# EAGLE design badge (EAGLE 6.5.0)
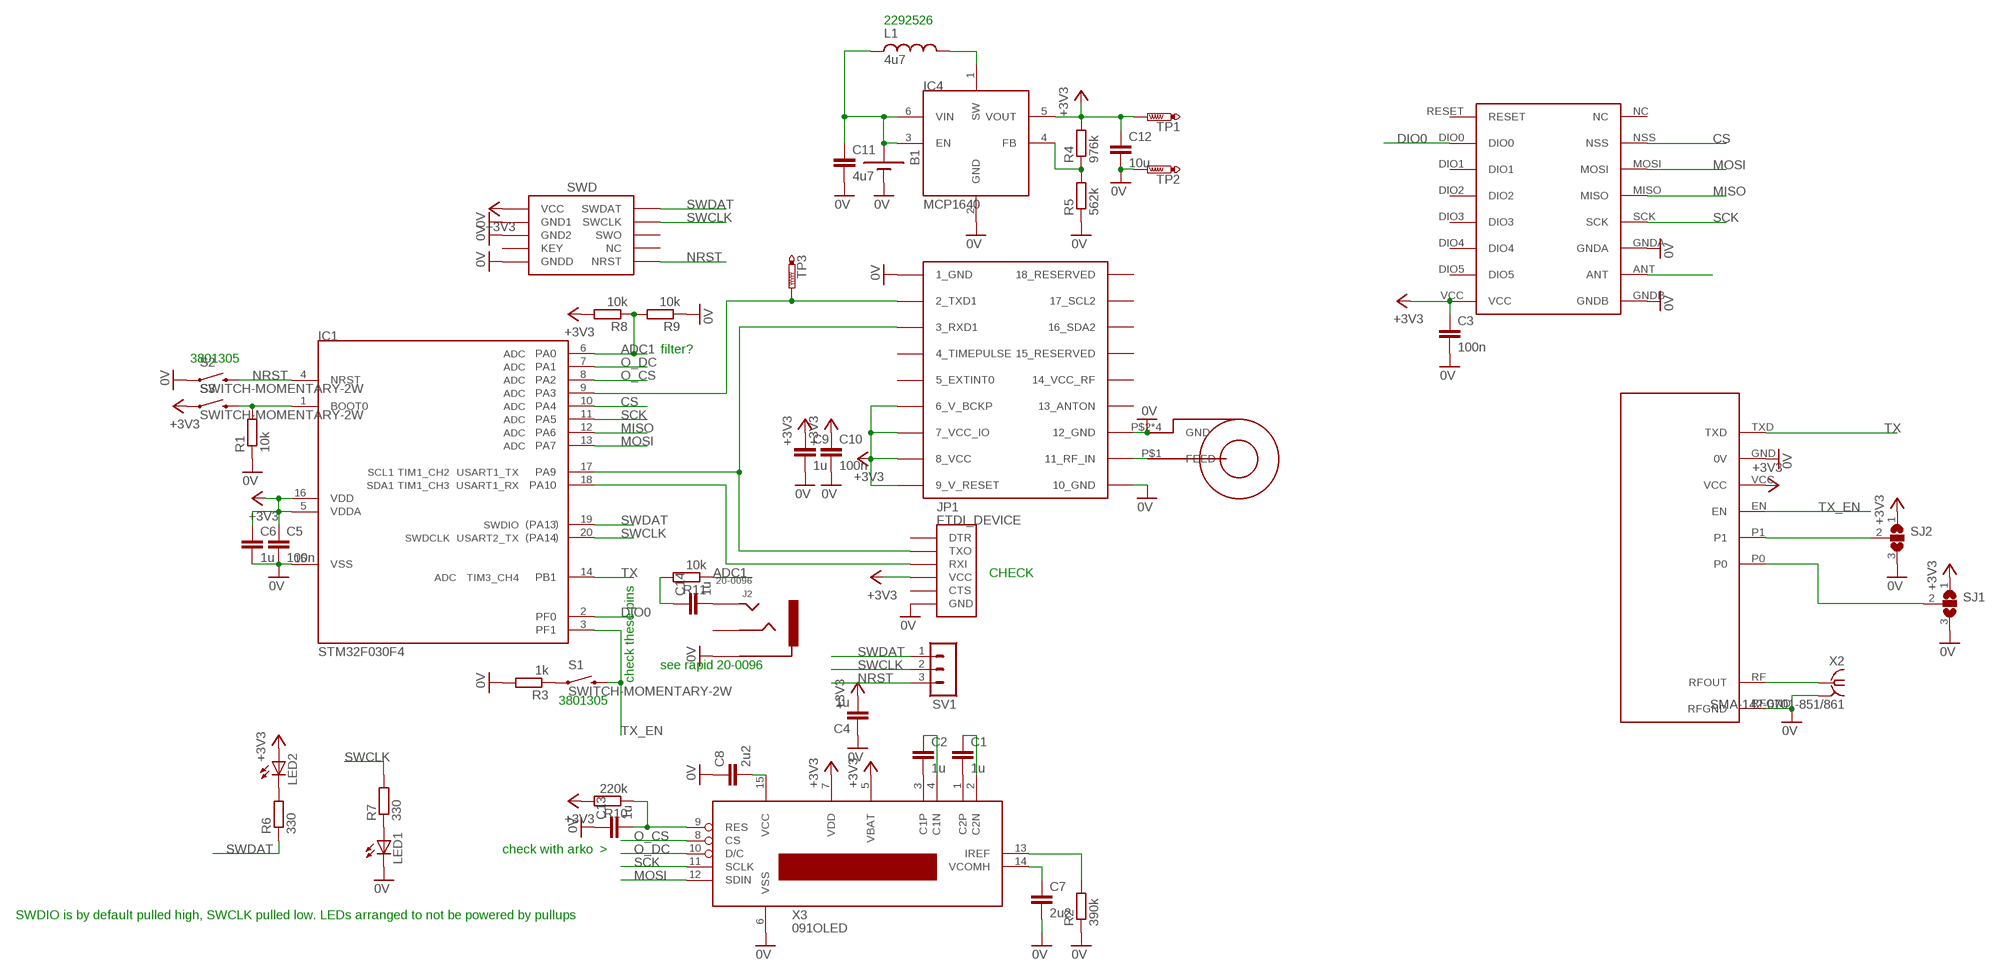
[diagram p0: schematic, sheet 1]

## Parts
B1  1.5V-BATTERY-AAA-SMT-CLIPS  [AAA-HOLDER-SMT-CLIPS]
C1  1u  C-EUC0603  [C0603]
C2  1u  C-EUC0603  [C0603]
C3  100n  C-EUC0603  [C0603]
C4  1u  C-EUC0603  [C0603]
C5  100n  C-EUC0603  [C0603]
C6  1u  C-EUC0603  [C0603]
C7  2u2  C-EUC0603  [C0603]
C8  2u2  C-EUC0603  [C0603]
C9  1u  C-EUC0603  [C0603]
C10  100n  C-EUC0603  [C0603]
C11  4u7  C-EUC0805  [C0805]
C12  10u  C-EUC0805  [C0805]
C13  1u  C-EUC0603  [C0603]
C14  1u  C-EUC0603  [C0603]
IC1  STM32F030F4  [TSSOP20]
IC2  UBLOX_MAX  [UBLOX_MAX]
IC3  RFM69HW  [RFM]
IC4  MCP1640  [SOT23-6]
J2  20-0096  3.5MMJACKSMD  [3.5MMLOWPROFILE]
J3  SWD_PTH_SHROUD  [SWD_PTH_SHROUD]
JP1  FTDI_DEVICE  [FTDI_DEVICE_SIDE]
L1  4u7  INDUCTOR  [INDUCTOR5X5]
LED1  LED0603  [LED-0603]
LED2  LED0603  [LED-0603]
R1  10k  R-EU_R0603  [R0603]
R2  390k  R-EU_R0603  [R0603]
R3  1k  R-EU_R0603  [R0603]
R4  976k  R-EU_R0603  [R0603]
R5  562k  R-EU_R0603  [R0603]
R6  330  R-EU_R0603  [R0603]
R7  330  R-EU_R0603  [R0603]
R8  10k  R-EU_R0603  [R0603]
R9  10k  R-EU_R0603  [R0603]
R10  220k  R-EU_R0603  [R0603]
R11  10k  R-EU_R0603  [R0603]
S1  SWITCH-MOMENTARY-2W  [TACTILE_WIDE]
S2  SWITCH-MOMENTARY-2W  [TACTILE_WIDE]
S3  SWITCH-MOMENTARY-2W  [TACTILE_WIDE]
SJ1  SJ2W  [SJ_2]
SJ2  SJ2W  [SJ_2]
SV1  MA03-1  [MA03-1]
TP1  PTR1B2,54  [B2,54]
TP2  PTR1B2,54  [B2,54]
TP3  PTR1B2,54  [B2,54]
U$2  JDGA-REMQV-ANTENNA  [JDGA-RIGID_COMBO_PAD]
X1  RADIOMETRIX-MTX2  [RADIOMETRIX-MTX2]
X2  SMA-142-0701-851/861  [J502-ND-142-0701-851/861]
X3  091OLED  [0.91OLEDCON]

## Nets
0V: B1.-1(-) B1.-2(-) C3.2 C4.1 C5.2 C6.2 C7.2 C8.1 C9.2 C10.2 C11.2 C12.2 C13.1 IC1.15(VSS) IC2.1_GND IC2.10_GND IC2.12_GND IC3.GNDA IC3.GNDB IC4.2(GND) J2.2_1 J2.2_2 J3.3(GND1) J3.5(GND2) J3.9(GNDD) JP1.P$6(GND) LED1.C R1.1 R2.1 R3.2 R5.1 R9.1 S2.A2 SJ1.3 SJ2.3 TP2.TP U$2.P$2(GND) U$2.P$3(GND) U$2.P$4(GND) U$2.P$5(GND) X1.GND(0V) X1.RFGND X2.G@1 X2.G@2 X2.G@3 X2.G@4 X3.6(VSS)
+3V3: C3.1 C4.2 C5.1 C6.1 C9.1 C10.1 C12.1 IC1.5(VDDA) IC1.16(VDD) IC2.6_V_BCKP IC2.7_VCC_IO IC2.8_VCC IC2.9_V_RESET IC3.VCC IC4.5(VOUT) J3.1(VCC) JP1.P$4(VCC) LED2.A R4.2 R8.2 R10.2 S3.A2 SJ1.1 SJ2.1 TP1.TP X1.VCC X3.5(VBAT) X3.7(VDD)
ADC1: IC1.6(PA0) R8.1 R9.2 R11.1
CS: IC1.10(PA4) IC3.NSS
DIO0: IC1.2(PF0) IC3.DIO0
MISO: IC1.12(PA6) IC3.MISO
MOSI: IC1.13(PA7) IC3.MOSI X3.12(SDIN)
N$1: IC2.11_RF_IN U$2.P$1(FEED)
N$2: IC1.9(PA3) IC2.2_TXD1 TP3.TP
N$3: LED2.C R6.2
N$4: X1.RF(RFOUT) X2.1
N$5: R2.2 X3.13(IREF)
N$6: IC3.ANT
N$7: IC1.1(BOOT0) R1.2 S3.B2
N$8: IC1.17(PA9) IC2.3_RXD1 JP1.P$2(TXO)
N$9: IC1.18(PA10) JP1.P$3(RXI)
N$10: C2.2 X3.3(C1P)
N$11: C1.2 X3.1(C2P)
N$12: C2.1 X3.4(C1N)
N$13: C1.1 X3.2(C2N)
N$14: IC4.4(FB) R4.1 R5.2
N$15: IC4.1(SW) L1.P$2
N$16: C7.1 X3.14(VCOMH)
N$17: LED1.A R7.1
N$18: SJ2.2 X1.P1
N$19: R3.1 S1.A2
N$20: SJ1.2 X1.P0
N$22: C13.2 R10.1 X3.9(RES)
N$23: C14.2 J2.4_1 J2.4_2
N$24: C14.1 R11.2
NRST: IC1.4(NRST) J3.10(NRST) S2.B2 SV1.3
O_CS: IC1.8(PA2) X3.8(CS)
O_DC: IC1.7(PA1) X3.10(D/C)
SCK: IC1.11(PA5) IC3.SCK X3.11(SCLK)
SWCLK: IC1.20(PA14) J3.4(SWCLK) R7.2 SV1.2
SWDAT: IC1.19(PA13) J3.2(SWDAT) R6.1 SV1.1
TX: IC1.14(PB1) X1.TXD
TX_EN: IC1.3(PF1) S1.B2 X1.EN
VCC: C8.2 X3.15(VCC)
VIN: B1.+1(+) B1.+2(+) C11.1 IC4.3(EN) IC4.6(VIN) L1.P$1
Unconnected: IC2.4_TIMEPULSE IC2.5_EXTINT0 IC2.13_ANTON IC2.14_VCC_RF IC2.15_RESERVED IC2.16_SDA2 IC2.17_SCL2 IC2.18_RESERVED IC3.DIO1 IC3.DIO2 IC3.DIO3 IC3.DIO4 IC3.DIO5 IC3.NC IC3.RESET J2.3_1 J2.3_2 J3.6(SWO) J3.7(KEY) J3.8(NC) JP1.P$1(DTR) JP1.P$5(CTS)

## Notes on the sheet
- 2292526
- 3801305 | filter?
- CHECK
- see rapid 20-0096
- check these pins
- 3801305
- check with arko  >
- SWDIO is by default pulled high, SWCLK pulled low. LEDs arranged to not be powered by pullups

## Library data of the parts
B1 = Battery:1.5V-BATTERY; EAGLEUP: AAA-HOLDER-SMT-CLIPS-WITH-BAT
C1-C14 = rcl:C-EU: CAPACITOR, European symbol
IC1 = dtb:STM32F030F4
IC2 = Ava:UBLOX_MAX: UBLOX MAX
IC3 = hoperf:RFM69HW
IC4 = ukhas:MCP1640
J2 = ukhas:3.5MMJACKSMD
J3 = dtb:SWD_PTH_SHROUD
JP1 = SparkFun-Connectors:FTDI_DEVICE: Connector which mates to FTDI basic or FTDI cable.
L1 = ukhas:INDUCTOR
LED1 LED2 = SparkFun-LED:LED: LEDs Standard schematic elements and footprints for 5mm, 3mm, 1206, and 0603 sized LEDs. 5mm - Spark Fun Electronics SKU : COM-00529 (and others)
R1-R11 = rcl:R-EU_: RESISTOR, European symbol
S1-S3 = ukhas:SWITCH-MOMENTARY-2: Various NO switches- pushbuttons, reed, etc
SJ1 SJ2 = jumper:SJ2W: SMD solder JUMPER
SV1 = Mine:MA03-1: PIN HEADER; OC_FARNELL: unknown; OC_NEWARK: unknown
TP1-TP3 = testpad:PTR1: TEST PIN
U$2 = Ava:JDGA-REMQV-ANTENNA
X1 = Ava:RADIOMETRIX-MTX2
X2 = con-coax:SMA-: SMA 50 Ohm End Launch Jack Receptacle - Round Contact Johnson Components Source: www.johnsoncomponents.com .. J502-ND.pdf; MF: JOHNSON COMPONENTS; MPN: 142-0701-851; OC_FARNELL: 1019325; OC_NEWARK: 99F6798
X3 = ukhas:091OLED

## Board
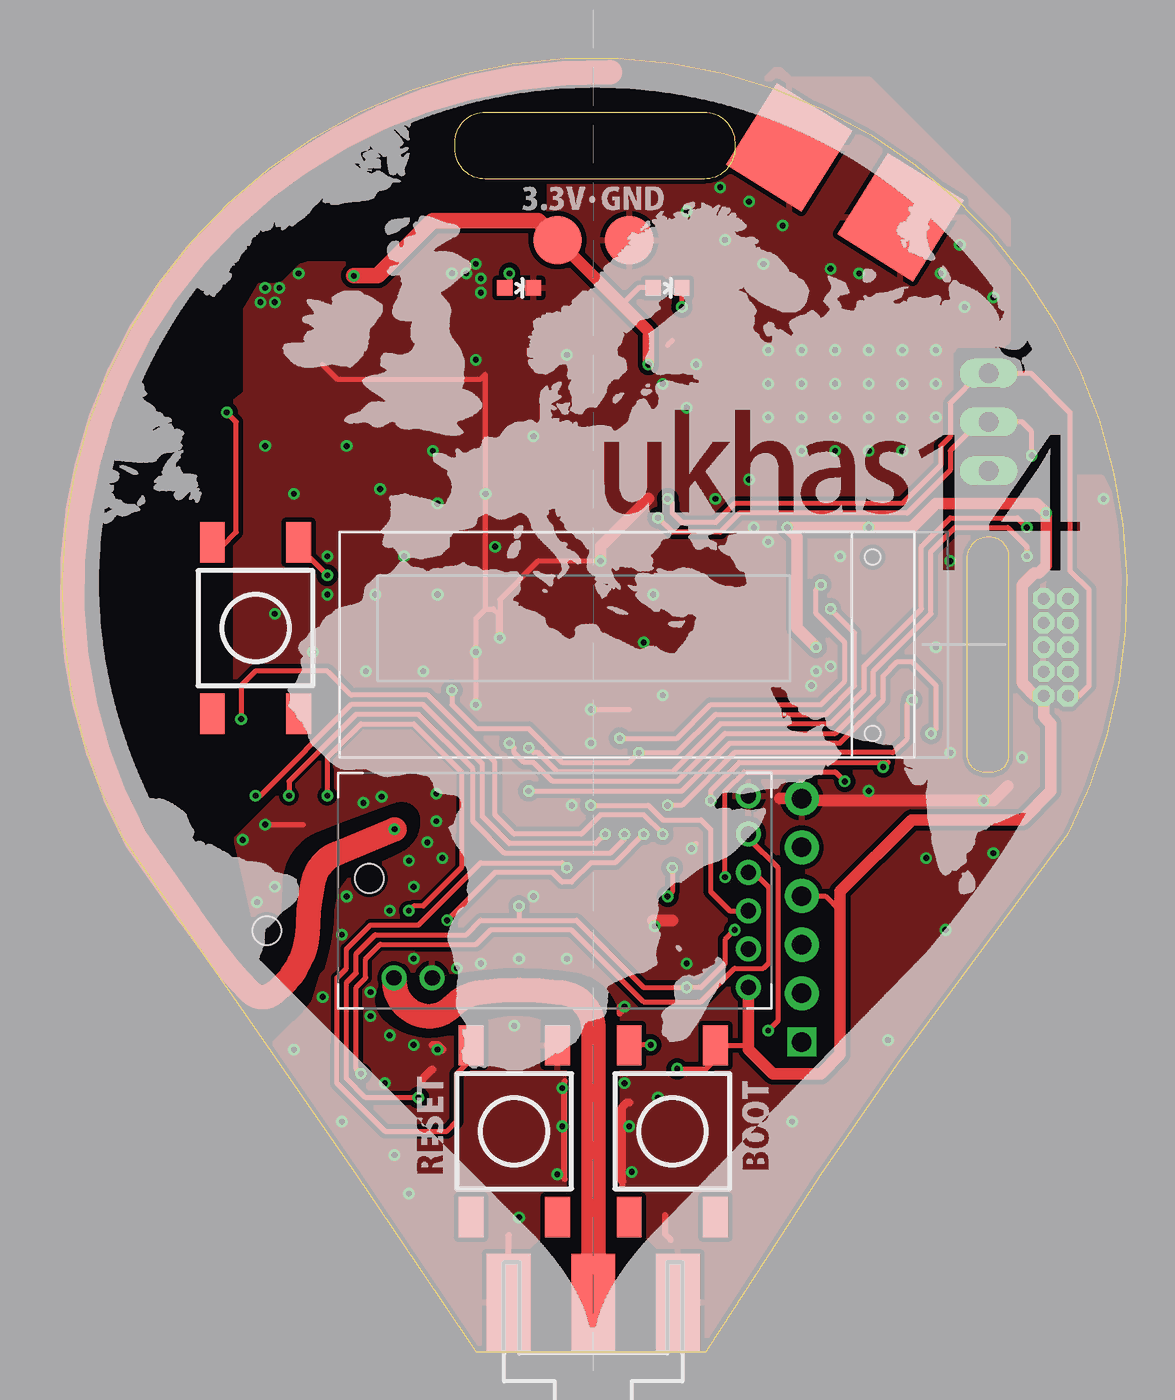
[diagram p1: board, top side]
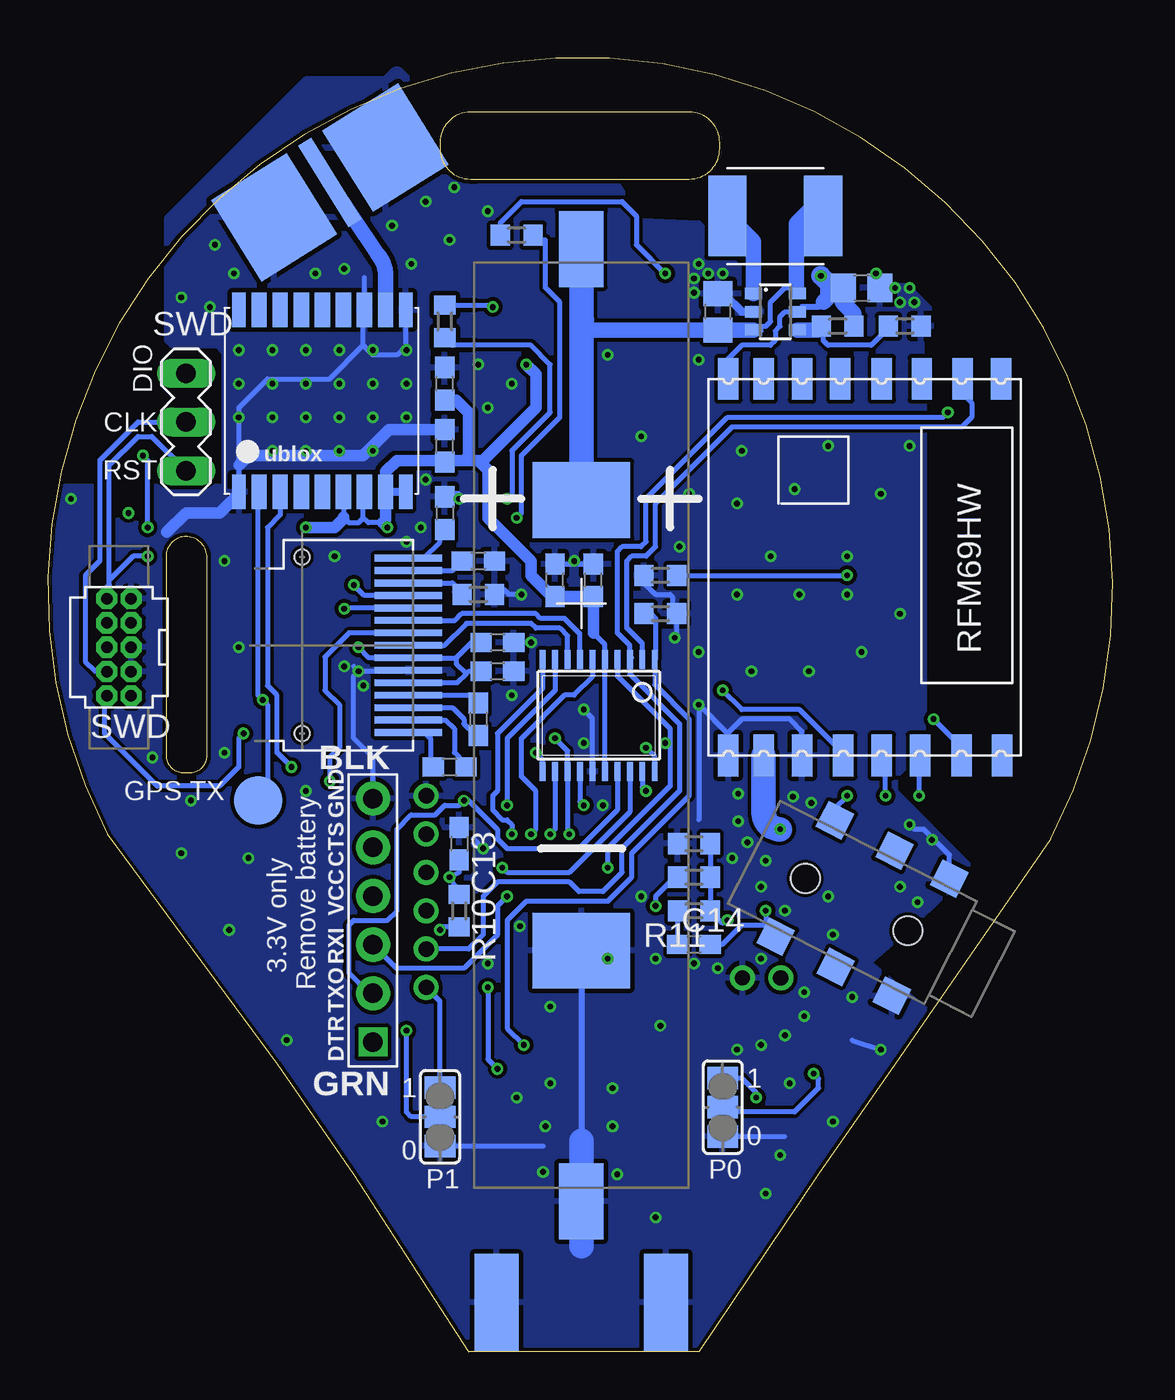
[diagram p2: board, bottom side, seen from below]

Size 55.55 x 67.49 mm. Coordinates in mm from the lower left corner, seen from the top.
Outline: 3.22,26.75 arc-235 52.47,27 43.59,15 39.59,9.25 33.59,0 21.59,0 15.34,9.25 11.34,15 3.22,26.75
Outline: 22.08,64.67 33.51,64.67 arc-90 35.1,63.08 35.1,62.77 arc-90 33.51,61.18 22.08,61.18 arc-90 20.49,62.77 20.49,63.08 arc-90 22.08,64.67
Outline: 48.36,42.53 arc-90 49.39,41.49 49.39,31.1 arc-90 48.51,30.22 48.12,30.22 arc-90 47.24,31.1 47.24,41.42 arc-90 48.36,42.53
Copper layers (1*16): Top 0.035mm / dielectric 1.5mm / Bottom 0.035mm
Design rules "Hackvana": minimum track width 0.15mm, minimum drill 0.3mm, track to track 6mil, track to pad 6mil, pad to pad 6mil, via to via 6mil, smd to smd 0mil, copper to edge 6mil, drill to drill 6mil, minimum pad ring 10mil, minimum via ring 6mil, stop-mask expansion 2mil, vias tented up to drill 100mil, thermal gap 10mil

### Footprints (pad centres in the part's own frame; a part is rotated, then mirrored left to right if it is on the bottom)
AAA-HOLDER-SMT-CLIPS = smd 3.962 x 2.337: +1 -24.841,0; -1 24.841,0 | smd 3.962 x 5.08: +2 -11.76,0; -2 11.76,0
C0603 = smd 1.1 x 1: 1 -0.85,0; 2 0.85,0
C0805 = smd 1.3 x 1.5: 1 -0.95,0; 2 0.95,0
TSSOP20 = smd 0.305 x 0.991: 1 -2.925,-2.918; 2 -2.275,-2.918; 3 -1.625,-2.918; 4 -0.975,-2.918; 5 -0.325,-2.918; 6 0.325,-2.918; 7 0.975,-2.918; 8 1.625,-2.918; 9 2.275,-2.918; 10 2.925,-2.918; 11 2.925,2.918; 12 2.275,2.918; 13 1.625,2.918; 14 0.975,2.918; 15 0.325,2.918; 16 -0.325,2.918; 17 -0.975,2.918; 18 -1.625,2.918; 19 -2.275,2.918; 20 -2.925,2.918
UBLOX_MAX = smd 1.8 x 0.7: 1_GND 4.95,-4.4; 9_V_RESET 4.95,4.3; 10_GND -4.55,4.3; 18_RESERVED -4.55,-4.4 | smd 1.8 x 0.8: 2_TXD1 4.95,-3.35; 3_RXD1 4.95,-2.25; 4_TIMEPULSE 4.95,-1.15; 5_EXTINT0 4.95,-0.05; 6_V_BCKP 4.95,1.05; 7_VCC_IO 4.95,2.15; 8_VCC 4.95,3.25; 11_RF_IN -4.55,3.25; 12_GND -4.55,2.15; 13_ANTON -4.55,1.05; 14_VCC_RF -4.55,-0.05; 15_RESERVED -4.55,-1.15; 16_SDA2 -4.55,-2.25; 17_SCL2 -4.55,-3.35
RFM = smd 2.184 x 1.067: ANT 19.651,2.889; DIO0 0,13.27; DIO1 0,11.143; DIO2 0,9.047; DIO3 0,6.889; DIO4 0,4.889; DIO5 0,2.889; GNDA 19.651,4.889; GNDB 19.651,1.048; MISO 19.651,9.047; MOSI 19.651,11.047; NC 19.651,15.334; NSS 19.651,13.206; RESET 0,15.27; SCK 19.651,7.048; VCC 0,1.048
SOT23-6 = smd 0.6 x 0.9: 1 -0.95,-1.15; 2 0,-1.15; 3 0.95,-1.15; 4 0.95,1.15; 5 0,1.15; 6 -0.95,1.15
3.5MMLOWPROFILE = smd 1.5 x 1.5: 2_1 1.8,-0.4; 2_2 1.7,6.4; 3_1 5,-0.4; 3_2 5,6.4; 4_1 8.5,-0.4; 4_2 8.5,6.4 | hole 1.5: 2.5,3; 8.5,3
SWD_PTH_SHROUD = drill 0.6 octagon: 1 -2.54,-0.635; 2 -2.54,0.635; 3 -1.27,-0.635; 4 -1.27,0.635; 5 0,-0.635; 6 0,0.635; 7 1.27,-0.635; 8 1.27,0.635; 9 2.54,-0.635; 10 2.54,0.635
FTDI_DEVICE_SIDE = drill 1 square: P$1 -6.35,0 | drill 1.016 pad 1.778: P$2 -3.81,0; P$3 -1.27,0; P$4 1.27,0; P$5 3.81,0; P$6 6.35,0
INDUCTOR5X5 = smd 2 x 4.2: P$1 5,2.5; P$2 0,2.5
LED-0603 = smd 0.8 x 0.8: A 0,-0.75; C 0,0.75
R0603 = smd 1 x 1.1: 1 -0.85,0; 2 0.85,0
TACTILE_WIDE = smd 2.1 x 1.3: A1 -4.475,-2.25; A2 4.475,-2.25; B1 -4.475,2.25; B2 4.475,2.25
SJ_2 = smd 1.168 x 1.6: 1 -1.524,0; 2 0,0; 3 1.524,0
MA03-1 = drill 1.016 long: 1 -2.54,0; 2 0,0; 3 2.54,0
B2,54 = smd 2.54 x 2.54: TP 0,0
JDGA-RIGID_COMBO_PAD = smd 0.8 x 5: P$1 0,0 | smd 4.65 x 5: P$2 -3.425,0; P$3 3.425,0 | smd 4.65 x 5 bottom: P$4 -3.425,0; P$5 3.425,0
RADIOMETRIX-MTX2 = drill 0.8: EN 9.97,-3.25; GND 9.97,4.75; P0 9.97,2.75; P1 9.97,0.75; RF -8.53,-4.75; RFGND -6.53,-4.75; TXD 9.97,-1.25; VCC 9.97,-5.25
J502-ND-142-0701-851/861 = smd 5.08 x 2.286: 1 2.565,0; G@1 2.565,4.42; G@2 2.565,-4.42 | smd 5.08 x 2.286 bottom: G@3 2.565,4.42; G@4 2.565,-4.42
0.91OLEDCON = smd 3.5 x 0.35: 1 -0.25,-4.55; 2 -0.25,-3.9; 3 -0.25,-3.25; 4 -0.25,-2.6; 5 -0.25,-1.95; 6 -0.25,-1.3; 7 -0.25,-0.65; 8 -0.25,0; 9 -0.25,0.65; 10 -0.25,1.3; 11 -0.25,1.95; 12 -0.25,2.6; 13 -0.25,3.25; 14 -0.25,3.9; 15 -0.25,4.55 | hole 0.8: -5.8,4.6; -5.8,-4.6

### Placement (x,y rotation side)
B1  27.72,32.68 270 bottom
C1  34.59,30.5 180 bottom
C2  33.09,33 270 bottom
C3  32.09,35.5 0 bottom
C4  32.09,37 180 bottom
C5  29.09,40.25 90 bottom
C6  27.09,40.25 90 bottom
C7  33.09,41.25 0 bottom
C8  34.84,43.75 270 bottom
C9  34.84,47.25 90 bottom
C10  34.84,50.5 90 bottom
C11  20.59,54.25 90 bottom
C12  13.09,55.5 0 bottom
C13  34.09,26.5 270 bottom
C14  21.84,21.25 0 bottom
IC1  26.81,33.19 180 bottom
IC2  41.18,49.8 270 bottom
IC3  21.09,50.75 270 bottom
IC4  17.59,54.25 270 bottom
J2  7.09,23.5 153 bottom
J3  51.84,36.75 90 bottom
JP1  38.59,22.5 90 bottom
L1  20.09,56.75 0 bottom
LED1  23.84,55.5 270 top
LED2  31.59,55.5 270 top
R1  23.59,38.5 180 bottom
R2  33.09,39.5 180 bottom
R3  23.59,40.5 180 bottom
R4  14.34,53.5 0 bottom
R5  10.84,53.5 180 bottom
R6  34.84,53.75 90 bottom
R7  31.09,58.25 0 bottom
R8  21.84,24.75 180 bottom
R9  21.84,26.5 0 bottom
R10  34.09,23 270 bottom
R11  21.84,23 180 bottom
S1  10.09,37.75 90 top
S2  23.59,11.5 90 top
S3  31.84,11.5 90 top
SJ1  35.09,12.25 270 bottom
SJ2  20.34,12.75 270 bottom
SV1  48.34,48.5 270 bottom
TP1  25.84,58 0 top
TP2  29.59,58 0 top
TP3  44.59,28.75 0 bottom
U$1  [0.91OLEDPANEL]  27.72,37.75 0 top
U$2  40.84,61 32 bottom
X1  25.84,24.25 0 top
X2  27.72,0 90 top
X3  36.49,36.85 0 bottom

### Tracks (layer width: path | path; a pad name or v marks a point on that pad's centre or on a via)
0V  (via drill 0.3)
  Top 0.254: v21.59,33.75 21.59,38.25 22.09,38.75 | 22.09,38.75 22.09,51 21.84,50.75 14.34,50.75 13.59,51.5 | v27.59,33.5 29.59,33.5 | v28.09,41.25 24.84,41.25 22.84,39.25 v22.84,37.25 22.74,37.35 R1.1 22.49,38.75 22.09,38.75 | 31.84,52.75 31.59,52.5 | v10.59,27.5 12.59,27.5 | v29.34,18 29.34,17.88 29.09,17.62 | 26.22,14.1 26.22,13.88 v26.09,13.75 | X1.GND 35.59,29 | 33.09,26.5 v32.84,26.25
  Top 0.305: X2.G@1 23.3,6.08 | 26.22,9 26.22,14.1 | 29.09,18 29.09,17.62 | 29.22,8.88 29.22,8.5 | 31.47,7.12 31.47,6.12 31.76,5.83
  Top 0.406: 19.31,14.72 18.84,14.25 | 19.34,16 19.59,16 19.84,15.75 | 25.34,16 25.84,15.5 S2.A2 | 29.22,8.88 29.22,12.75 29.47,13 29.59,13
  Top 0.61: 37.44,28.85 JP1.P$6 38.59,28.75 48.59,28.75 49.34,29.5 | 31.84,22.5 30.84,22.5 | 30.59,44.5 28.09,42 v28.09,41.25
  Bottom 0.254: v39.34,35.5 36.54,35.5 | JP1.P$6 38.59,31 39.59,32 39.59,35.25 v39.34,35.5 | 39.03,56.03 IC2.12_GND 39.09,54.29 39.09,52.5 | 27.72,8.75 B1.-1 28.11,8.23 28.63,8.75 | IC1.15 27.14,33.05 v27.59,33.5 | v30.84,39.5 31.49,39.5 31.74,39.75 | IC2.1_GND 45.58,46.25 45.58,49.26 44.09,50.75 40.84,50.75 39.09,52.5 | IC2.10_GND 36.88,52.46 37.34,52 38.59,52 39.09,52.5 | 21.59,27.75 v21.59,33.75 20.05,32.2 IC3.GNDB 20.09,31.15 20.09,32.25 19.34,33 16.84,33 16.21,32.36 IC3.GNDA | 39.59,35.75 v39.34,35.5 | C5.2 C6.2 28.19,41.1 | 24.09,40.15 R3.2 24.44,40.1 23.84,39.5 23.09,39.5 22.97,39.38 22.97,38.73 R1.1 | R1.1 22.74,38.65 | R1.1 22.74,37.35 v22.84,37.25 | J2.2_2 11.51,18.33 | 13.59,16.25 v12.09,15.75 | J2.2_1 8.52,25.92 9.84,27.25 10.34,27.25 v10.59,27.5 | SJ2.3 17.12,11.23 | SJ1.3 29.7,10.73 | v32.84,26.25 33.34,26.75
  Bottom 0.305: B1.-2 27.72,8.62 28.11,8.23
  Bottom 0.406: C11.2 20.29,55.2 19.34,54.25 IC4.2
  Bottom 0.61: 29.59,22.5 29.34,22.25 29.05,22.25 B1.-2 | IC2.1_GND 45.58,44.76 46.59,43.75 48.34,43.75 49.34,42.75 | C9.2 37.74,48.1 39.09,46.75 45.08,46.75 45.58,46.25 | C8.1 34.19,44.6 v34.09,44.5
  Bottom 1.27: 27.72,5.5 27.72,11
  other vias: 31.34,34.25 30.34,37 19.84,25.75 29.72,9.38 50.09,31 43.84,47 43.84,50.5 42.09,47 42.09,48.75 42.09,50.5 42.09,52.25 40.34,47 43.84,52.25 45.59,52.25 45.59,50.5 43.84,48.75 45.59,48.75 40.34,48.75 40.34,50.5 40.34,52.25 38.59,48.75 38.59,50.5 38.59,52.25 36.84,52.25 36.84,50.5 36.84,48.75 38.59,47 46.84,57.75 45.84,56.25 41.59,56.25 40.09,56.5 37.59,58.75 35.84,60 34.34,60.75 36.59,56.75 34.59,58 48.59,55 47.09,54.5 19.59,15.75 23.59,17 26.09,11.75 25.84,9.25 23.84,7 17.34,10.25 18.09,8.25 29.34,14 20.59,20 21.84,20.25 16.84,14 16.09,17.5 17.09,16.5 29.59,11.75 31.09,13.25 21.59,36.5 18.84,35.5 15.84,35.5 13.09,36.5 11.09,38.5 13.84,39.5 16.34,39.5 19.59,39.5 13.84,41.5 17.84,41.5 22.59,42 22.09,44.75 19.34,47 19.59,44.25 10.59,47.25 12.09,44.75 14.84,47.25 16.59,45 26.34,52 24.59,47.75 27.59,31.75 26.59,28.5 48.59,26 46.09,22 45.09,25.75 42.09,29.25 38.09,12 26.34,20.5 18.34,16 11.09,24.25 14.59,21.75 24.59,23.75 32.59,59.5 20.34,56.25 21.09,56.25 21.84,55.25 21.84,56 11.34,55.5 11.09,54.75 10.34,54.75 12.34,56.25 13.59,18.5 32.59,20.25 18.1,25.62 19.05,26.57 19.53,27.68 16.67,28.95 15.72,28.63 19.53,29.11 39.09,34.75 40.09,35.75 36.09,43 36.84,42.25 35.84,45.5 43.09,16.25 21.59,51.75 21.59,56.75 10.59,55.5 23.84,20.5 18.34,20.5 14.84,23.75 17.09,23 18.34,24.25 14.59,12 16.09,18.75 9.42,26.7 10.17,23.45 30.92,22.2 40.59,41.5 46.34,41.25 45.59,36.75 46.34,31.25 48.09,28.75 54.34,44.5 33.09,51.5 32.59,49.25 31.34,50.5
  pour Bottom (isolate 0.254): 35.97,65.62 37.22,66.88 37.47,66.88 37.97,66.38 42.09,66.38 49.34,59.12 49.34,52.75 49.09,52.5 46.72,52.5 46.34,52.12 46.34,43.25 45.84,42.75 33.72,42.75 33.59,42.88 27.84,43.38 30.09,60.75
  pour Top (isolate 0.254): 35.97,65.62 37.22,66.88 37.47,66.88 37.97,66.38 42.09,66.38 49.34,59.12 49.34,52.75 49.09,52.5 46.72,52.5 46.34,52.12 46.34,43.25 45.84,42.75 33.72,42.75 32.84,43.62 32.84,63
  pour Top (isolate 0.254): 33.09,63 33.09,51.5 34.47,50.12 34.47,45.88 35.59,44.75 44.72,44.75 45.59,45.62 54.22,45.62 55.59,43 55.59,37.25 54.77,33.67 54.67,32.42 54.09,31.25 52.77,27.41 33.23,-0.04 21.72,-0.25 10.72,15.75 13.09,18 13.59,19.62 16.84,22.88 19.47,22.88 21.97,25.38 21.97,31.5 20.47,33 9.09,33 9.09,42.88 8.47,44.25 8.47,49.12 9.59,50 9.59,54.38 10.34,55.62 11.47,55.62 12.47,56.62 12.84,56.75 17.34,56.75 19.59,58.75 24.47,58.75 25.47,59.75 25.47,62.12 27.09,63.75
  pour Bottom (isolate 0.203): 36.47,4.75 37.84,6.81 49.59,22.75 51.59,25.88 54.72,32.25 55.72,41 55.09,45.12 39.47,45.12 33.09,51.5 33.09,51.88 32.97,52.75 32.97,61.62 31.97,62.62 26.97,62.62 24.59,59 21.59,58.88 19.09,56.12 10.72,55.62 9.47,54.38 9.47,53.5 9.59,52.88 9.97,52.62 9.97,51.25 9.84,49.75 9.84,31.5 11.59,29.75 19.47,29.75 21.72,27.5 21.72,21.75 20.72,20.75 15.09,22.25 9.47,17.62 16.22,7.62 21.47,-0.12 33.4,0.03 36.08,3.98
  pour Top: 11.34,31.75 11.34,29.25 14.59,30.75 arc90 16.09,31.25 arc5 22.09,25.75 22.84,25.5 23.34,25.75 23.34,30.5 21.09,32.75 12.34,32.75
  pour Bottom (isolate 0.203): 11.34,31.75 11.34,29.25 7.59,25.5 arc90 7.59,25 arc5 13.59,19.5 18.34,15 24.84,21.25 23.34,30.5 21.09,32.75 12.34,32.75
  pour Top (isolate 0.203): 19.23,33.72 23.34,25.5 19.84,22.5 12.84,15 11.34,16 13.34,18.5 13.84,20 arc16 14.34,22.75 arc-18 14.59,24 arc-49 15.59,25 arc7 17.84,26 arc66 18.84,27.75 arc107 17.34,28.75 arc2 13.34,27.25 arc70 11.34,24.25 arc-15 11.09,22 arc-152 10.34,22 arc62 10.09,22.25 9.09,26.75 15.68,33.31
+3V3  (via drill 0.3)
  Top 0.254: v18.59,13.25 15.84,13.25 14.84,14.25 14.84,19.25 15.34,19.75 15.34,20.75 16.34,21.75 21.09,21.75 21.84,22.5 23.84,22.5 | JP1.P$4 39.82,23.77 40.59,23 | v32.09,14.75 33.59,14.75 34.09,15.25 S3.A2 35.79,15.98 35.81,16 | 23.84,22.5 26.84,22.5 30.34,19 v32.59,19 33.34,19 34.59,20.25 34.59,21.5 v35.09,22 | LED2.A 30.09,55.5 29.22,54.62 | v23.84,23.25 23.84,22.5
  Top 0.61: v39.34,36.75 38.34,37.75 38.34,42.5 v37.84,43 v42.09,43 44.34,43 45.59,44.25 50.84,44.25 v51.34,43.75 51.34,41 50.97,40.62 50.72,40.62 50.09,40 50.09,34.88 50.76,34.21 J3.1 51.22,33.12 51.59,32.75 51.59,29.25 50.09,27.75 44.34,27.75 40.59,24 40.59,23 40.59,15.5 39.59,14.5 37.09,14.5 35.81,15.78 35.81,16 X1.VCC | 26.59,58 TP1.TP 29.22,54.62 30.59,53.25 v30.59,51.5
  Top 0.813: TP1.TP 24.84,59 19.34,59 16.47,56.12 v15.22,56.12
  Bottom 0.254: 34.24,36.2 X3.7 38.79,36.2 v39.34,36.75 | IC2.6_V_BCKP 40.13,43.54 39.84,43.25 39.34,43.25 39.09,43.5 | 39.09,43.5 39.09,44.79 IC2.7_VCC_IO | 37.93,43.41 38.09,43.25 38.84,43.25 39.09,43.5 | IC1.16 IC1.5 26.49,36.9 27.09,37.5 | 27.09,39.15 C6.1 | v32.59,19 32.59,15.25 v32.09,14.75 | C5.1 28.44,39.4 28.34,39.5 | SJ1.1 35.09,18.28 X1.VCC | v18.59,13.25 18.59,13.5 19.34,14.25 20.32,14.25 SJ2.1 | 14.84,55.5 14.79,55.55 14.64,55.55 14.63,55.54 14.54,55.45 14.09,55.45 | 15.84,54.5 16.19,54.5 | 16.84,54.25 IC4.5 17.09,54.25 17.34,54 17.34,53.5 17.59,53.25 17.59,52.75 17.84,52.5 19.34,52.5 20.09,51.75 20.09,50.8 IC3.VCC | X3.5 34.19,34.9 33.72,35.38 | 33.72,35.38 33.59,35.5 C3.1 | 34.24,36.2 34.24,35.9 33.72,35.38 | C4.2 33.44,37 34.24,36.2 | 23.84,23.5 v23.84,23.25 23.84,23.75 22.94,24.65 22.59,24.65 R8.2 | R10.2 35.24,22.15 v35.09,22
  Bottom 0.305: 15.09,54.75 15.34,54.5 16.19,54.5 IC4.5
  Bottom 0.406: IC2.9_V_RESET IC2.8_VCC
  Bottom 0.61: 40.13,43.54 40.13,43.46 40.59,43 v42.09,43 | 38.09,43.25 v37.84,43 | 27.09,37.5 27.09,39.15 | C6.1 C5.1 29.24,39.4 30.34,40.5 30.34,41.25 32.59,43.5 32.59,46 33.09,46.5 | 33.09,46.5 33.84,46.5 | 33.84,46.5 34.74,46.5 C9.1 34.94,46.5 37.34,46.5 37.93,45.91 IC2.8_VCC 37.93,43.41 | C10.1 34.24,49.65 33.59,49 33.59,46.75 33.84,46.5 | 33.09,46.5 32.84,46.5 30.09,49.25 30.09,51 v30.59,51.5
  Bottom 0.813: R4.2 13.49,54.15 14.09,54.75 14.09,55.45 C12.1 | 14.84,55.5 14.84,55 15.09,54.75
  Bottom 1.016: v15.22,56.12 v15.21,56.12 14.63,55.54
ADC1  (via drill 0.3)
  Top 0.254: v30.34,27 28.84,25.5 27.59,25.5 26.59,24.5 26.09,24.5 25.59,25 22.59,25 v20.09,22.5
  Bottom 0.254: IC1.6 27.14,35.2 28.09,34.25 28.59,34.25 30.84,32 30.84,30 30.09,29.25 30.09,27.25 v30.34,27 | R9.2 R8.1 | R8.1 20.99,25.15 | v20.09,22.5 20.34,22.35 R11.1 R8.1
CS  (via drill 0.3)
  Top 0.254: v9.34,33 9.34,34.75 10.09,35.5 13.84,35.5 15.09,34.25 19.09,34.25 22.59,30.75 22.59,28 23.59,27 27.09,27 28.09,28 30.34,28 v31.34,27
  Bottom 0.254: IC1.10 29.74,34.6 32.09,32.25 32.09,29.25 32.34,29 32.34,28.25 31.84,27.75 31.59,27.75 31.34,27.5 v31.34,27 | IC3.NSS 8.09,31.3 8.09,31.75 v9.34,33
DIO0
  Bottom 0.254: IC1.2 24.54,36.95 25.34,37.75 25.34,41.25 25.09,41.5 24.34,41.5 23.84,42 23.84,44.25 19.84,48.25 7.84,48.25 7.34,48.75 7.34,49.5 7.82,49.98 IC3.DIO0
MISO  (via drill 0.3)
  Top 0.254: v29.34,27 29.34,26.75 28.59,26 23.09,26 21.43,27.66 21.43,30.41 18.59,33.25 15.34,33.25 11.84,29.75 v11.84,29
  Bottom 0.254: IC1.12 29.09,27.26 v29.34,27 | v11.84,29 11.84,30.9 IC3.MISO
MOSI  (via drill 0.3)
  Top 0.254: v28.34,27 27.84,26.5 23.34,26.5 21.93,27.91 21.93,30.66 18.84,33.75 15.09,33.75 10.34,29 v10.09,29 | v29.09,32 32.09,32 33.84,33.75 39.59,33.75 40.84,35 40.84,37 39.34,38.5 39.34,39.75 v39.59,40
  Bottom 0.254: v28.34,27 28.44,27.09 IC1.13 28.44,31.34 v29.09,32 | 39.34,39.75 v39.59,40 39.04,39.45 X3.12 | v10.09,29 10.09,31.05 IC3.MOSI
N$1
  Bottom 0.813: IC2.11_RF_IN 37.93,56 arc-45 38.34,57.25 U$2.P$1
N$2  (via drill 0.3)
  Top 0.254: v31.59,28.5 32.34,28.5 35.09,31.25 43.34,31.25 44.09,32 44.09,33.75 v44.34,34
  Bottom 0.254: 44.53,34.19 v44.34,34 | IC1.9 29.09,34.51 31.59,32 v31.59,28.5 | v44.34,34 44.09,33.75 44.09,29.25 TP3.TP | IC2.2_TXD1 44.59,44.79 44.59,34.25 v44.34,34
N$3  (via drill 0.3)
  Top 0.254: v32.34,54.5 LED2.C
  Bottom 0.254: R6.2 32.44,54.6 v32.34,54.5
N$4
  Top 0.254: 27.72,1.94 arc90 X2.1
  Top 1.27: 27.72,1.94 27.72,16.75 arc93 25.84,18.75 arc14 21.84,18.75 arc39 20.34,18 arc-48 19.09,17.5 arc-85 17.34,19.25 X1.RF
N$5
  Bottom 0.254: X3.13 34.44,40.1 34.34,40 34.34,39.65 34.19,39.5 R2.2
N$6  (via drill 0.3)
  Top 1.27: 28.59,66.75 arc61 4.09,53.25 arc58 3.84,26.75 arc2 8.09,20.75 arc10 9.84,18.75 arc88 11.09,18.75 arc52 12.84,22.25 arc-12 13.09,24.5 arc-55 14.34,26 v17.34,27.25
  Bottom 1.27: IC3.ANT 18.21,28.11 arc-90 v17.34,27.25
N$7  (via drill 0.3)
  Top 0.254: v30.72,16 29.62,16 S3.B2
  Bottom 0.254: R1.2 24.09,38.5 23.84,38.25 23.84,36.15 IC1.1 23.89,34.8 22.09,33 22.09,29 25.09,26 25.09,24.75 26.34,23.5 30.59,23.5 31.59,22.5 31.59,16.88 v30.72,16
N$8  (via drill 0.3)
  Top 0.254: v42.84,30.5 43.09,30.75 35.34,30.75 33.84,29.25 v33.84,28.75
  Bottom 0.254: IC2.3_RXD1 43.43,43.66 44.09,43 44.09,34.75 43.59,34.25 43.59,31.25 v42.84,30.5 | IC1.17 25.84,28.26 27.84,26.25 31.59,26.25 32.09,26.75 32.09,27.25 33.59,28.75 v33.84,28.75 34.09,28.5 34.84,28.5 35.34,28 36.59,28 37.34,27.25 37.34,23 37.84,22.5 39.59,22.5 39.84,22.25 39.84,19.75 38.78,18.69 JP1.P$2
N$9  (via drill 0.3)
  Top 0.254: v31.84,25.25 31.84,24 v31.59,23.75
  Bottom 0.254: IC1.18 25.19,28.16 28.34,25 31.59,25 v31.84,25.25 | v31.59,23.75 32.09,23.25 32.09,21.75 33.84,20 37.36,20 JP1.P$3
N$10
  Bottom 0.254: X3.3 34.44,33.6 33.84,33 33.84,32.75 33.59,32.5 33.19,32.5 33.09,32.4 C2.2
N$11
  Bottom 0.254: X3.1 35.89,32.3 35.59,32 35.59,30.65 C1.2
N$12
  Bottom 0.254: X3.4 33.49,34.25 C2.1
N$13
  Bottom 0.254: X3.2 34.79,32.95 34.34,32.5 34.34,31.25 33.84,30.75 33.84,30.6 C1.1
N$14
  Bottom 0.254: R5.2 11.69,53.4 12.59,52.5 14.84,52.5 15.09,52.75 15.09,53.5 | 15.09,53.5 15.09,53.65 | R4.1 15.09,53.5
  Bottom 0.813: IC4.4 15.39,53.3 R4.1
N$15
  Bottom 0.813: IC4.1 18.74,57.9 L1.P$2
N$16
  Bottom 0.254: X3.14 34.44,40.75 C7.1
N$17  (via drill 0.3)
  Top 0.254: v23.34,56.25 23.34,55.75 LED1.A
  Bottom 0.254: R7.1 31.94,58.9 30.84,60 25.59,60 24.84,59.25 24.84,57.75 v23.34,56.25
N$18  (via drill 0.3)
  Top 0.254: X1.P1 36.09,25 36.84,24.25 36.84,20.25 36.59,20 35.09,20 33.34,18.25 30.34,18.25 26.59,22 22.34,22 21.59,21.25 16.59,21.25 15.84,20.5 15.84,19.5 15.34,19 15.34,14.75 v15.59,14.5
  Bottom 0.254: SJ2.2 20.09,12.5 16.59,12.5 15.34,13.75 15.34,14.25 v15.59,14.5
N$19  (via drill 0.3)
  Top 0.254: S1.A2 12.34,42 v13.84,40.5
  Bottom 0.254: R3.1 v13.84,40.5
N$20  (via drill 0.3)
  Top 0.254: X1.P0 35.81,26.78 37.34,25.25 37.34,17.25 v36.84,16.75
  Bottom 0.254: SJ1.2 36.59,12.25 36.84,12.5 v36.84,16.75
N$21
  cutout Top: 19.34,19.5 20.84,19.75 arc-10 24.09,20 arc-9 26.84,19.75 arc-71 29.09,17.5 29.09,7 29.34,7 31.59,4.75 31.59,-0.25 30.84,-1 24.59,-1 23.09,0.5 23.09,4 26.34,7.25 26.34,16.5 25.59,17 arc31 24.09,17.5 arc27 21.34,17 20.84,16.75 arc-67 16.84,17.25 arc-45 16.34,18.25 arc-51 16.84,19.5 arc-57 17.84,19.75
N$22  (via drill 0.3)
  Top 0.254: v34.59,24.75 34.59,29.25 35.59,30.25 40.34,30.25 v40.84,29.75
  Bottom 0.254: X3.9 39.84,37.5 41.09,36.25 41.09,34.5 40.34,33.75 40.34,31.5 40.84,31 v40.84,29.75 | R10.1 34.09,24 v34.59,24.75 34.09,25 C13.2
N$23  (via drill 0.3)
  Top 0.254: v13.84,29 13.84,31 15.59,32.75 18.34,32.75 20.84,30.25 20.84,25.25 18.84,23.25 18.34,23.25 v18.09,23
  Bottom 0.254: J2.4_1 14.49,28.36 v13.84,29 | C14.2 20.34,21.25 19.34,22.25 18.17,22.25 J2.4_2 18.09,22.18 v18.09,23
N$24
  Bottom 0.254: R11.2 C14.1
NRST  (via drill 0.3)
  Top 0.254: v26.34,25.25 26.09,25.5 21.84,25.5 18.59,22.25 16.09,22.25 14.84,21 14.84,20 14.34,19.5 14.34,14 16.84,11.5 20.09,11.5 20.59,12 20.59,14.5 21.34,15.25 S2.B2 | v50.34,41.5 50.34,42 49.34,43 46.59,43 45.34,41.75 45.34,38.5 42.34,35.5 42.34,34.25 40.34,32.25 34.59,32.25 32.09,29.75 25.59,29.75 24.59,30.75 24.09,30.75 23.59,31.25 23.59,31.5 v23.34,31.75
  Bottom 0.254: IC1.4 25.84,35.24 23.09,32.5 23.09,32 | J3.10 52.48,39.87 52.34,40 52.34,40.25 | 52.34,40.25 52.34,46.25 50.84,47.75 50.13,47.75 SV1.3 | 23.09,32 23.09,29.5 26.34,26.25 v26.34,25.25 | v50.34,41.5 51.09,41.5 52.34,40.25 | v23.34,31.75 23.09,32
O_CS
  Bottom 0.254: X3.8 34.87,36.85 33.72,38 30.34,38 30.09,37.75 28.84,37.75 28.44,37.34 IC1.8
O_DC
  Bottom 0.254: IC1.7 27.79,37.45 28.59,38.25 29.84,38.25 30.09,38.5 33.97,38.5 34.32,38.15 X3.10
SCK  (via drill 0.3)
  Top 0.254: v40.09,38.75 41.34,37.5 41.34,34.75 39.84,33.25 34.09,33.25 32.09,31.25 v30.09,31.25 29.59,30.75 26.09,30.75 24.34,32.5 21.59,32.5 20.34,33.75 v20.34,34.5
  Bottom 0.254: IC1.11 29.74,30.9 v30.09,31.25 | X3.11 40.04,38.8 v40.09,38.75 | IC3.SCK 13.94,31.1 16.34,33.5 19.34,33.5 v20.34,34.5
SWCLK  (via drill 0.3)
  Top 0.254: v50.34,43 49.84,43.5 46.34,43.5 44.84,42 44.84,38.75 41.84,35.75 41.84,34.5 40.09,32.75 34.34,32.75 31.84,30.25 25.84,30.25 24.84,31.25 24.59,31.25 v24.34,31.5 | v50.59,46.75 50.59,48 50.09,48.5 SV1.2 47.84,48.5 46.34,47 46.34,46 44.09,43.75 35.34,43.75 34.34,42.75 31.84,42.75 v31.09,43.5
  Bottom 0.254: J3.4 52.5,35.5 53.09,35.5 53.59,36 53.59,40.5 52.84,41.25 52.84,46.5 50.84,48.5 SV1.2 | v50.34,43 50.34,46.5 v50.59,46.75 | v31.09,43.5 30.84,43.75 30.84,46.75 28.84,48.75 28.84,54.75 29.59,55.5 29.59,58 29.99,58 R7.2 | IC1.20 23.89,31.05 v24.34,31.5
SWDAT  (via drill 0.3)
  Top 0.254: J3.2 53.05,34.21 53.59,34.75 53.59,39.75 52.59,40.75 52.59,49 50.55,51.04 SV1.1 47.88,51.04 46.34,49.5 46.34,47.75 45.84,47.25 45.84,46.25 43.84,44.25 35.09,44.25 34.09,43.25 32.34,43.25 31.84,43.75 31.84,44.25 v31.59,44.5 | v24.34,29.25 32.34,29.25 34.84,31.75 40.59,31.75 42.84,34 42.84,35.25 43.59,36 44.34,36 45.59,34.75 45.59,32.5 v45.34,32.25
  Bottom 0.254: v45.34,32.25 45.59,32 45.59,30.5 46.59,29.5 49.84,29.5 52.59,32.25 52.59,34.09 J3.2 | v31.59,44.5 31.34,44.5 31.34,47 29.34,49 29.34,51.5 30.34,52.5 34.44,52.5 R6.1 | IC1.19 24.54,29.45 v24.34,29.25
TX  (via drill 0.3)
  Top 0.254: 35.81,23.03 X1.TXD 34.84,23 33.84,24 33.84,27.25 33.34,27.75 31.34,27.75 30.59,28.5 v27.59,28.5
  Bottom 0.254: IC1.14 27.79,28.7 v27.59,28.5
TX_EN  (via drill 0.3)
  Top 0.254: v8.59,49 9.09,48.5 9.09,42.75 8.32,41.98 8.09,41.98 S1.B2
  Bottom 0.254: v8.59,49 8.84,48.75 20.09,48.75 24.34,44.5 24.34,42.25 24.59,42 25.59,42 25.84,41.75 25.84,37.5 25.19,36.84 IC1.3 | IC1.3 25.19,35.34 22.59,32.75 22.59,29.25 25.59,26.25 25.59,25 26.59,24 27.84,24 28.34,24.5 32.09,24.5 32.84,23.75 32.84,21.75 33.59,21 X1.EN | 25.09,36.2 IC1.3
VCC
  Bottom 0.254: X3.15 35.94,41.4 35.09,42.25 35.09,42.65 C8.2
VIN
  Bottom 0.254: 27.67,53.3 27.72,53.25 | IC4.3 18.69,53.25 18.34,53.25 18.34,53.5 18.09,53.5 17.84,53.75 17.84,54.75 17.09,55.5 16.49,55.5 16.49,55.25 IC4.6
  Bottom 0.813: IC4.3 C11.1 27.67,53.3 | 16.49,55.5 16.49,58.85 15.84,59.5 15.34,59.5 L1.P$1
  Bottom 1.27: B1.+2 27.72,53.25 27.72,53.88 | 27.72,53.88 B1.+1 | 27.7,53.85 27.72,53.88

### Text on the board
tPlace: C:/Users/Daniel/Documents/GitHub/ukhas14-badge/board/graphics/silkscreen.bmp
bPlace: SWD | DIO | CLK | RST | SWD | Remove battery | GPS TX | 3.3V only | 1 | 1 | 0 | 0 | P0 | P1